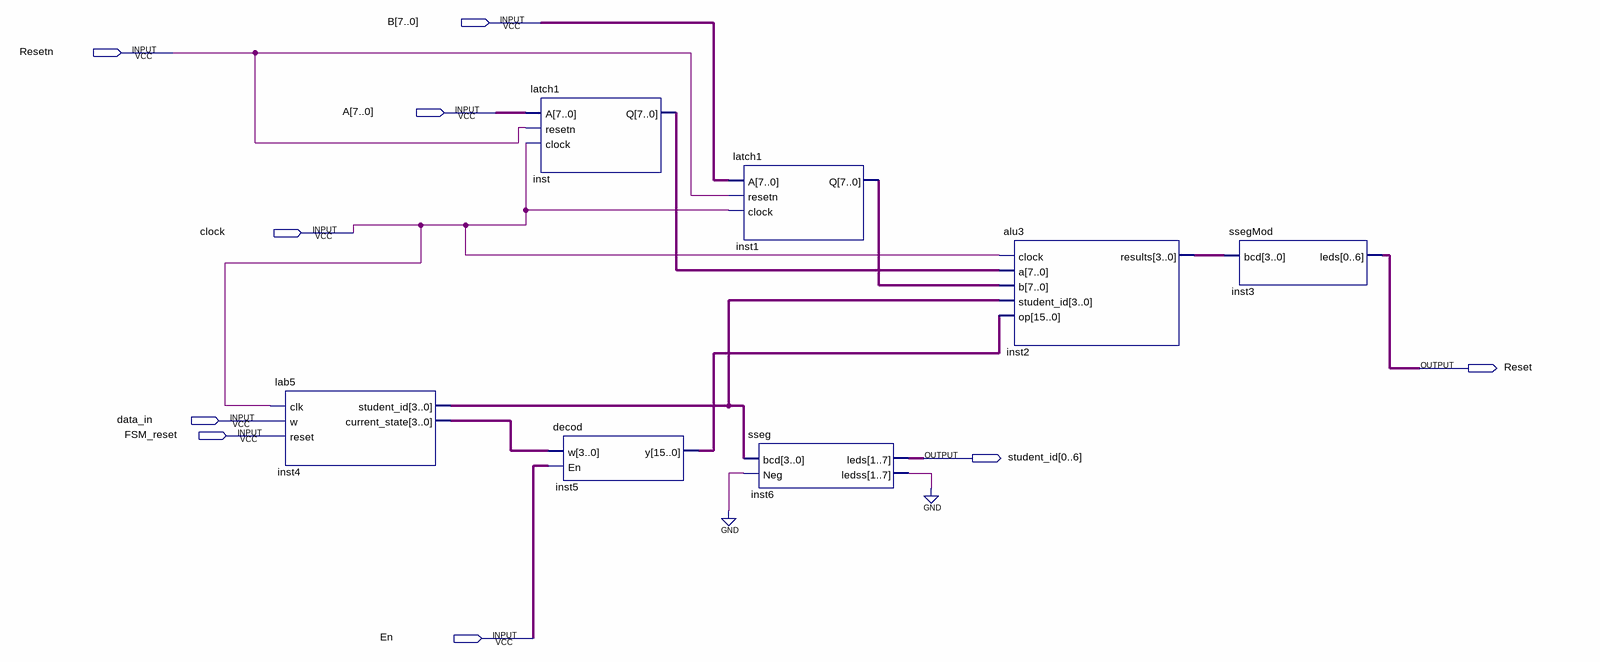
[diagram p0: schematic sheet]
// Quartus schematic gpu3.bdf as structural Verilog: 7 symbols, 9 pins
module gpu3 (
  input  [7:0] B,
  input  Resetn,
  input  [7:0] A,
  input  clock,
  input  data_in,
  input  FSM_reset,
  input  En,
  output Reset,
  output [0:6] student_id
);

  wire inst6_ledss;
  wire [3:0] inst2_results, inst4_current_state, inst4_student_id;
  wire [6:0] inst3_leds;
  wire [7:0] inst1_q, inst_q;
  wire [15:0] inst5_y;

  lab5 inst4 (
    .clk(clock), .w(data_in), .student_id(inst4_student_id), .current_state(inst4_current_state));  // open: reset
  latch1 inst (.A(A), .resetn(Resetn), .clock(clock), .Q(inst_q));
  decod inst5 (.w(inst4_current_state), .En(En), .y(inst5_y));
  latch1 inst1 (.A(B), .resetn(Resetn), .clock(clock), .Q(inst1_q));
  sseg inst6 (.bcd(inst4_student_id), .Neg(1'b0), .leds(student_id), .ledss(inst6_ledss));
  alu3 inst2 (
    .clock(clock), .a(inst_q), .b(inst1_q), .student_id(inst4_student_id), .op(inst5_y),
    .results(inst2_results));
  ssegMod inst3 (.bcd(inst2_results), .leds(inst3_leds));
  // also tied to GND on the sheet: inst6_ledss
endmodule
